# Altium schematic sheet RevisionHistory.SchDoc
size A4; Organization: Altium Limited; Address1: L3, 12a Rodborough Rd; Address2: Frenchs Forest; Address3: NSW; Address4: Australia 2086; DocumentNumber: 5; SheetNumber: 5; SheetTotal: 5
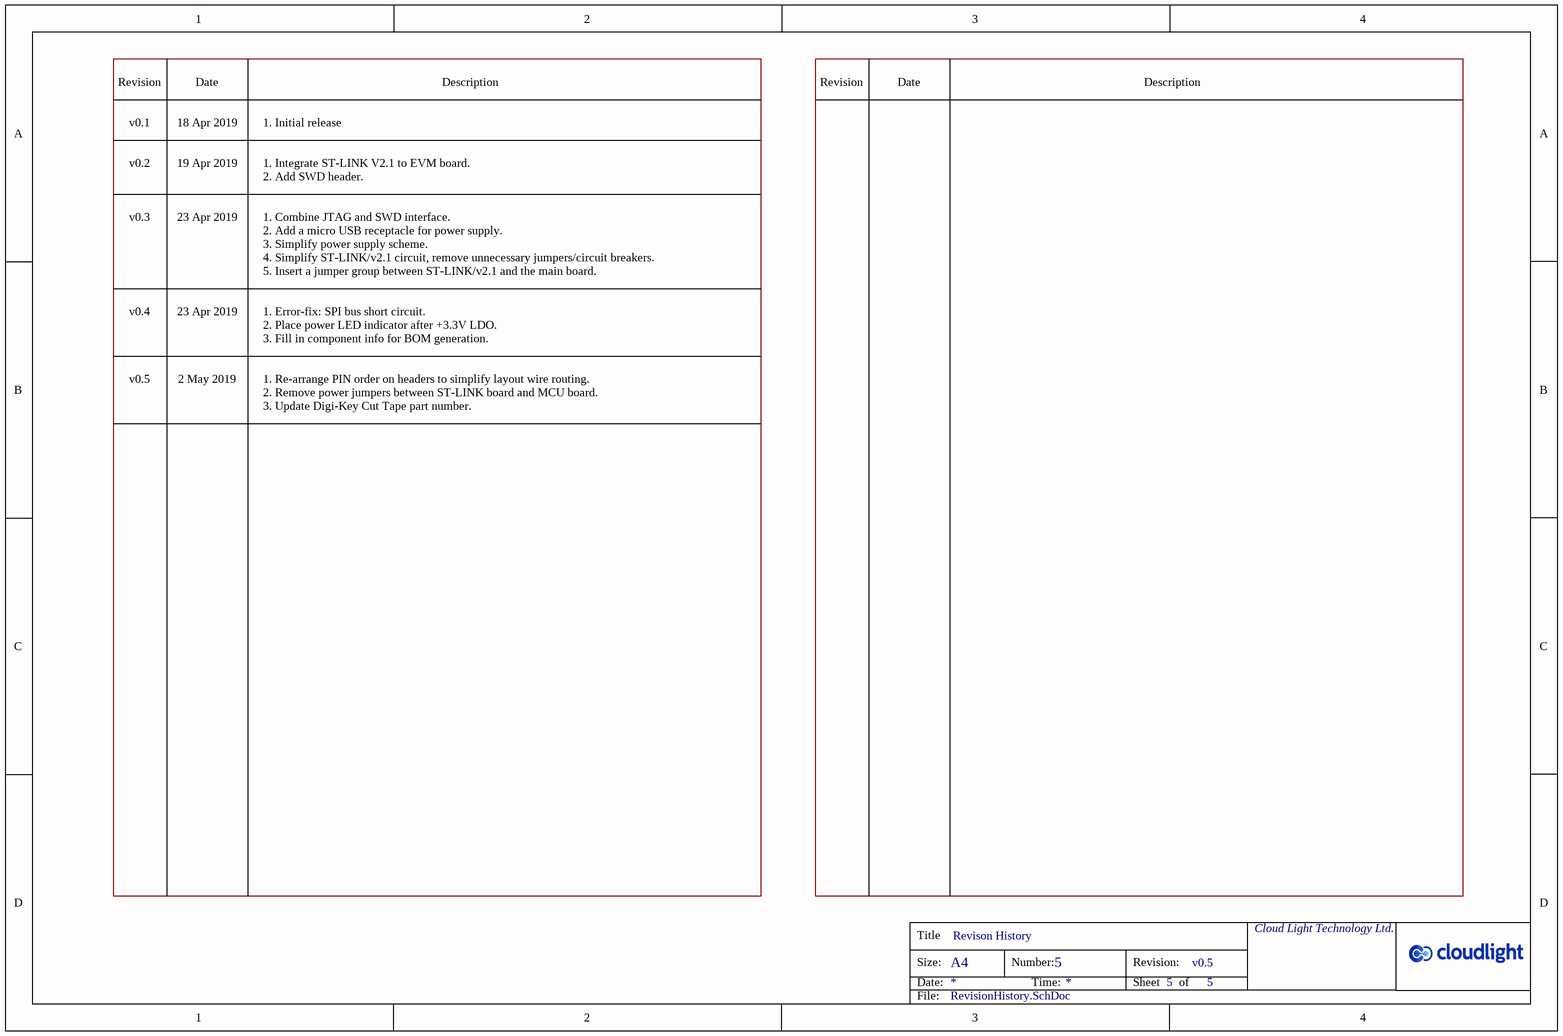
[diagram p0: RevisionHistory.SchDoc]

## Notes on the sheet
- Revision
- Date
- Description
- v0.1
- v0.2
- 18 Apr 2019
- 19 Apr 2019
- 1. Initial release
- 1. Integrate ST-LINK V2.1 to EVM board.
  2. Add SWD header.
- v0.3
- 23 Apr 2019
- v0.4
- 1. Combine JTAG and SWD interface.
  2. Add a micro USB receptacle for power supply.
  3. Simplify power supply scheme.
  4. Simplify ST-LINK/v2.1 circuit, remove unnecessary jumpers/circuit breakers.
  5. Insert a jumper group between ST-LINK/v2.1 and the main board.
- v0.5
- 2 May 2019
- 1. Error-fix: SPI bus short circuit.
  2. Place power LED indicator after +3.3V LDO.
  3. Fill in component info for BOM generation.
- 1. Re-arrange PIN order on headers to simplify layout wire routing.
  2. Remove power jumpers between ST-LINK board and MCU board.
  3. Update Digi-Key Cut Tape part number.
- Title
- Size:
- Date:
- A4
- Revison History
- Number:
- Time:
- Revision:
- Sheet
- 5
- of
- Cloud Light Technology Ltd.
- File:
- RevisionHistory.SchDoc